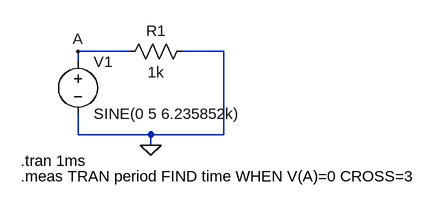
[diagram p0: schematic 2a.asc]
2a.asc, the LTspice schematic file:
Version 4
SHEET 1 988 680
WIRE 192 64 112 64
WIRE 336 64 272 64
WIRE 112 80 112 64
WIRE 112 192 112 160
WIRE 224 192 112 192
WIRE 336 192 336 64
WIRE 336 192 224 192
WIRE 224 208 224 192
FLAG 224 208 0
FLAG 112 64 A
SYMBOL voltage 112 64 R0
WINDOW 123 0 0 Left 0
WINDOW 39 0 0 Left 0
SYMATTR InstName V1
SYMATTR Value SINE(0 5 6.235852k)
SYMBOL res 288 48 R90
WINDOW 0 0 56 VBottom 2
WINDOW 3 32 56 VTop 2
SYMATTR InstName R1
SYMATTR Value 1k
TEXT 24 232 Left 2 !.tran 1ms
TEXT 24 256 Left 2 !.meas TRAN period FIND time WHEN V(A)=0 CROSS=3

The netlist it stands for:
* 2a.asc
V1 A 0 SINE(0 5 6.235852k)
R1 0 A 1k
.tran 1ms
.meas TRAN period FIND time WHEN V(A)=0 CROSS=3
.backanno
.end

* Results of the author's LTspice run, read from the files saved beside the schematic
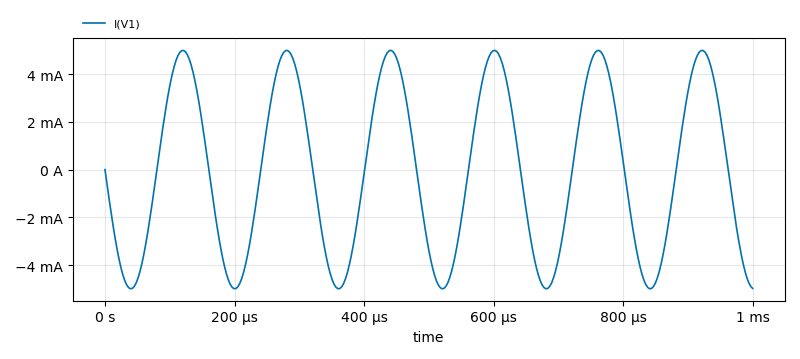
[diagram p1: Transient Analysis of 2a.asc, plotted from the saved traces]
* Transient Analysis, 1 run:
*   I(V1): min -4.998 mA, max 4.997 mA, average -116.1 µA, rms 3.53 mA, last -4.98 mA
* From the log:
*   period: time=0.000160363 at 0.000160363